# Altium schematic sheet ProxSensorType2_Recieve.SchDoc
size A4; SheetNumber: 3; SheetTotal: 3
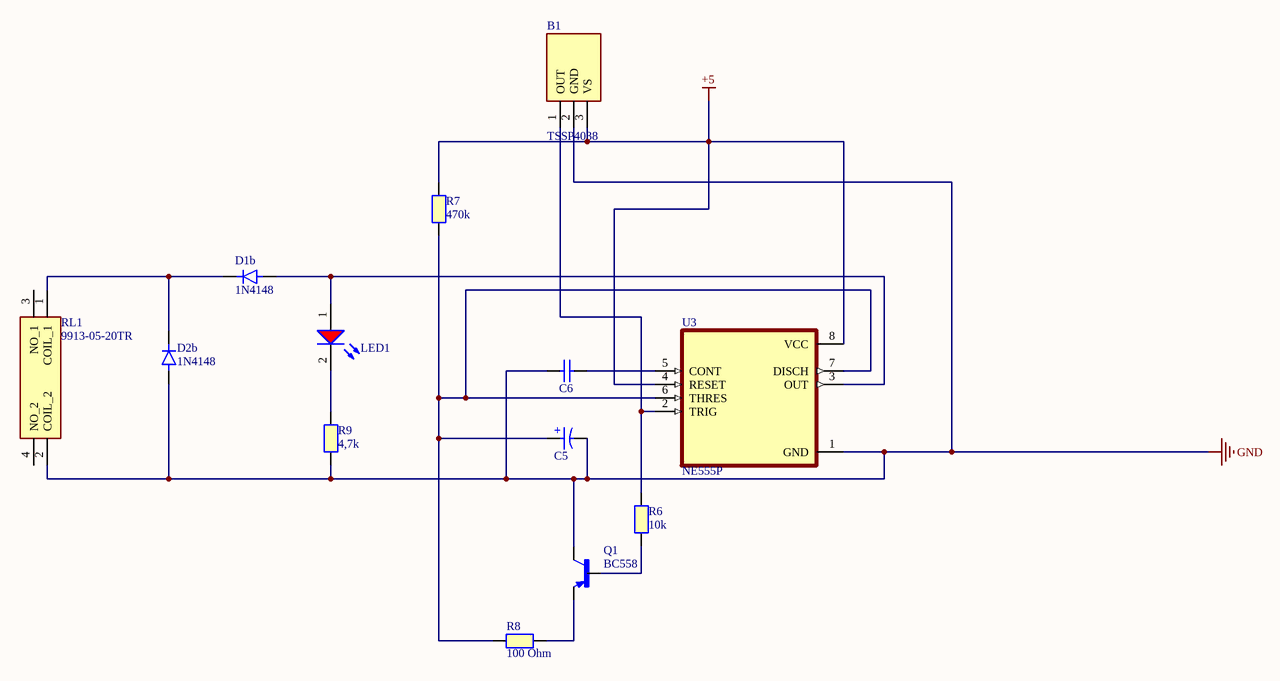
[diagram p0: ProxSensorType2_Recieve.SchDoc]

## Parts
B1  TSSP4038  [TSSP4038]
C5  4,7µF  [WCAP-ATG8_D5H11]  (value not drawn)
C6  0,01uF  [WCAP-CSGP_0805_L2W1.25H0.8_Wave]  (value not drawn)
D1b  1N4148  [DIOAD829W49L456D191]
D2b  1N4148  [DIOAD829W49L456D191]
LED1  Super Red, 2.1V, 40°  [WL-TMRC_D5.9H8.7]  (value not drawn)
Q1  BC558
R6  10k  [RESC2012X50N]
R7  470k  [RESC2012X50N]
R8  100 Ohm  [RESC2012X50N]
R9  4,7k  [RESC2012X50N]
RL1  9913-05-20TR  [99130520TR]
U3  NE555P  [DIP794W45P254L959H508Q8]

## Nets
+5: B1.3(VS) R7.2 U3.4(RESET) U3.8(VCC)
GND: B1.2(GND) C5.2(N) C6.1 D2b.A Q1.1(C) R9.1 RL1.2(COIL_2) U3.1(GND)
NetB1_1: B1.1(OUT) R6.2 U3.2(TRIG)
NetC5_1: C5.1(P) R7.1 R8.1 U3.6(THRES) U3.7(DISCH)
NetC6_2: C6.2 U3.5(CONT)
NetD1b_A: D1b.A LED1.1(A) U3.3(OUT)
NetD1b_C: D1b.C D2b.C RL1.1(COIL_1)
NetLED1_2: LED1.2(K) R9.2
NetQ1_2: Q1.2(B) R6.1
NetQ1_3: Q1.3(E) R8.2

Not connected (* = marked no-connect by the designer): RL1 3(NO_1) 4(NO_2)

## Notes on the sheet
- (in symbol 860010272005) +

## Library data of the parts
B1 = TSSP4038: IR Receiver Module 38KHz 25m EMI 3-Pin Vishay TSSP4038, 38kHz IR Receiver, 950nm +/-45 , 25m Range, 2.5V - 5V, Through Hole, 6 x 3.9 x 6.95mm; Mouser Part Number: 782-TSSP4038; Mouser Price/Stock: https://www.mouser.co.uk/ProductDetail/Vishay-Semiconductors/TSSP4038?qs=lgjwDzixuo3Ja5hn%252BEmOdw%3D%3D; Manufacturer_Name: Vishay; Manufacturer_Part_Number: TSSP4038; Datasheet Link: https://componentsearchengine.com/Datasheets/2/TSSP4038.pdf
C5 = 860010272005: WCAP-ATG8 Aluminum Electrolytic Capacitor, Radial, THT, D5 x H11mm, 100µF, 10V; Manufacturer: Wurth Elektronik; Capacitance Tolerance: +/-20%; Dissipation Factor: 19%; Endurance: 2000h; Leakage Current: 10µA; Ripple Current: 198mA; Technical Reference: ATBC110101M010DSPA3B000; Manufacturer Part Number: 860010272005; Category: Aluminum Electrolytic Capacitors; Match Code: WCAP-ATG8; ComponentLink1Description: Website Link; ComponentLink1URL: https://www.we-online.com/redexpert/article/860010272005?ad; ComponentLink2Description: Datasheet Link; ComponentLink2URL: https://www.we-online.com/redexpert/spec/860010272005?ad; Mount: Through Hole; Operating Temperature Max: 85°C; Operating Temperature Min: -40°C; Packaging: Ammo Pack; Height: 11mm; Diameter: 5mm; Capacitance: 100µF; Rated Voltage (DC): 10V
C6 = 885012004008: WCAP-CSGP Multilayer Ceramic Chip Capacitor, General Purpose, size 0201, NP0 Class I, 22pF, 25VDC; Manufacturer: Wurth Elektronik; Case/Size Code: 0201; Capacitance Tolerance: +/-5%; Insulation Resistance: 10GΩ; Q Factor: 840; Rated Voltage (DC): 25V; Technical Reference: NP00201220J025DFCT10000; Manufacturer Part Number: 885012004008; Category: Multilayer Ceramic Chip Capacitors; Match Code: WCAP-CSGP; ComponentLink1Description: Website Link; ComponentLink1URL: https://www.we-online.com/redexpert/article/885012004008?ad; ComponentLink2Description: Datasheet Link; ComponentLink2URL: https://www.we-online.com/redexpert/spec/885012004008?ad; Mount: Surface Mount; Operating Temperature Max: 125°C; Operating Temperature Min: -55°C; Packaging: Tape and Reel; Length: 0.6mm; Width: 0.3mm; Height: 0.3mm; Capacitance: 22pF; Ceramic Type: NP0 Class I
D1b D2b = 1N4148: Diode Standard 75V 200mA Surface Mount SOD-523F; MF: ON Semiconductor; Price: None; Availability: In Stock; Package: AXIAL LEAD-2 ON Semiconductor; MP: 1N4148; Value: *; SnapEDA_Link: https://www.snapeda.com/parts/1N4148/Onsemi/view-part/?ref=snap; Purchase-URL: https://pricing.snapeda.com/search/part/1N4148/?ref=eda; Check_prices: https://www.snapeda.com/parts/1N4148/Onsemi/view-part/?ref=eda
LED1 = LED_151051SS04000: WL-TMRC Mono-color Round Color, THT, D5.9 x H8.7mm, Super Red, 2.1V, 40°; Manufacturer: Wurth Elektronik; Case/Size Code: 5mm; Chip Technology: AlInGaP; Dominant Wavelength: 635nm; Luminous Intensity: 250mcd; Peak Wavelength: 640nm; Manufacturer Part Number: 151051SS04000; Category: Signal LEDs; Match Code: WL-TMRC; ComponentLink1Description: Website Link; ComponentLink1URL: https://www.we-online.com/redexpert/article/151051SS04000?ad; ComponentLink2Description: Datasheet Link; ComponentLink2URL: https://www.we-online.com/redexpert/spec/151051SS04000?ad; Mount: Through Hole; Operating Temperature Max: 85°C; Operating Temperature Min: -40°C; Packaging: Bulk; Height: 8.7mm; Diameter: 5.9mm; Emitting Color: Super Red; Forward Voltage: 2.1V; Viewing Angle: 40°
Q1 = BC558: Bipolar (BJT) Transistor PNP 30 V 100 mA 360MHz 625 mW Through Hole TO-92 (TO-226); MF: ON; Price: None; Availability: In Stock; MP: BC558; Package: TO-226-3 Diotec Semiconductor; SnapEDA_Link: https://www.snapeda.com/parts/BC558/Onsemi/view-part/?ref=snap; Check_prices: https://www.snapeda.com/parts/BC558/Onsemi/view-part/?ref=eda; Value: *; Purchase-URL: https://pricing.snapeda.com/search/part/BC558/?ref=eda
R6-R9 = RESISTOR 0805: 4,7k Resistor 0805; Part Number: TNPW080510K0BETA; Manufacturer: Vishay Dale
RL1 = 9913-05-20TR: RELAY STANDARD REED, 5V, 200 OHMS, J FORM, TR. / TAPE-REEL; Manufacturer_Name: Coto Technology; Geometry.Height: 3.61mm; Mouser Part Number: 816-9913-05-20TR; Mouser Price/Stock: https://www.mouser.co.uk/ProductDetail/Coto-Technology/9913-05-20TR?qs=BJlw7L4Cy7%2Ft0vFUsUT%2FEw%3D%3D; Manufacturer_Part_Number: 9913-05-20TR; Datasheet Link: https://componentsearchengine.com/Datasheets/1/9913-05-20TR.pdf
U3 = NE555P: Package: None; Price: None; Value: *; MP: NE555P; Availability: Unavailable